# EAGLE design cd4017_ir_remote (EAGLE 8.3.2)
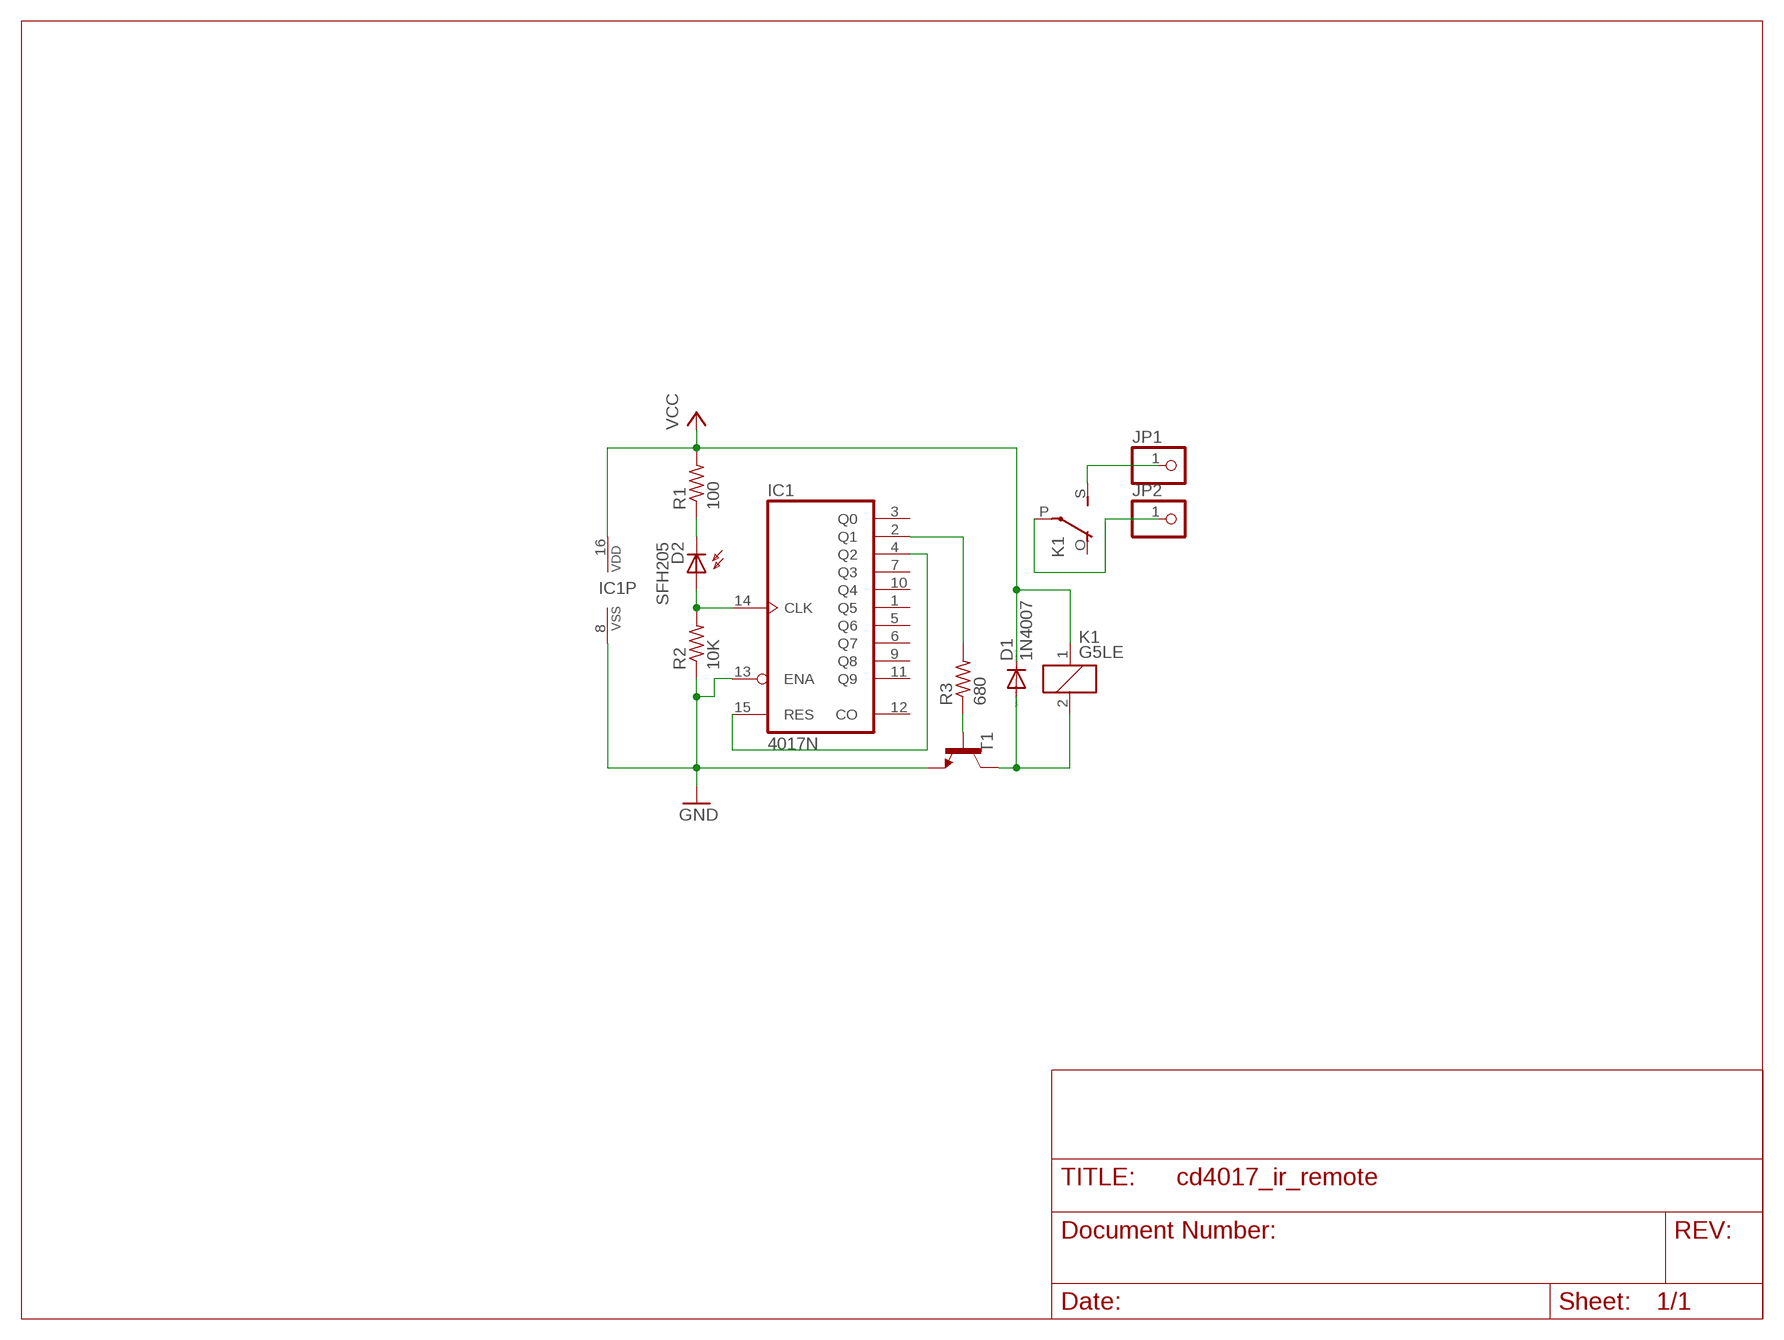
[diagram p0: schematic, sheet 1]

## Parts
D1  1N4007  1N4004  [DO41-10]
D2  SFH205  [SFH205]
IC1  4017N  [DIL16]
JP1  PINHD-1X1  [1X01]
JP2  PINHD-1X1  [1X01]
K1  G5LE  [G5LE]
R1  100  R-US_0204/7  [0204/7]
R2  10K  R-US_0204/7  [0204/7]
R3  680  R-US_0204/7  [0204/7]
T1  2N2222-NPN-TO92-EBC  [TO92-EBC]

## Nets
GND: IC1.8(VSS) IC1.13(ENA) R2.1 T1.E
N$1: IC1.4(Q2) IC1.15(RES)
N$2: R3.1 T1.B
N$3: D1.A K1.2 T1.C
N$4: IC1.2(Q1) R3.2
N$5: D2.A IC1.14(CLK) R2.2
N$6: D2.K(C) R1.1
N$7: JP2.1 K1.P(2:P)
N$8: JP1.1 K1.S(2:S)
VCC: D1.C IC1.16(VDD) K1.1 R1.2
Unconnected: IC1.1(Q5) IC1.3(Q0) IC1.5(Q6) IC1.6(Q7) IC1.7(Q3) IC1.9(Q8) IC1.10(Q4) IC1.11(Q9) IC1.12(CO) K1.O(2:O)

## Library data of the parts
D1 = diode:1N4004: DIODE general purpose rectifier, 1 A
D2 = opto-trans-siemens:SFH205: PHOTO DIODE; OC_FARNELL: unknown; OC_NEWARK: unknown
IC1 = 40xx:4017: COUNTER/DIVIDER
JP1 JP2 = pinhead:PINHD-1X1: PIN HEADER
K1 = relay:G5LE: RELAY 1 x switch, 10 A/120 V AC, 8 A/30 V DC, Omron; OC_FARNELL: unknown; OC_NEWARK: unknown
R1-R3 = resistor:R-US_: RESISTOR, American symbol
T1 = transistor-neu-to92:*-NPN-: NPN Transistror

## Board
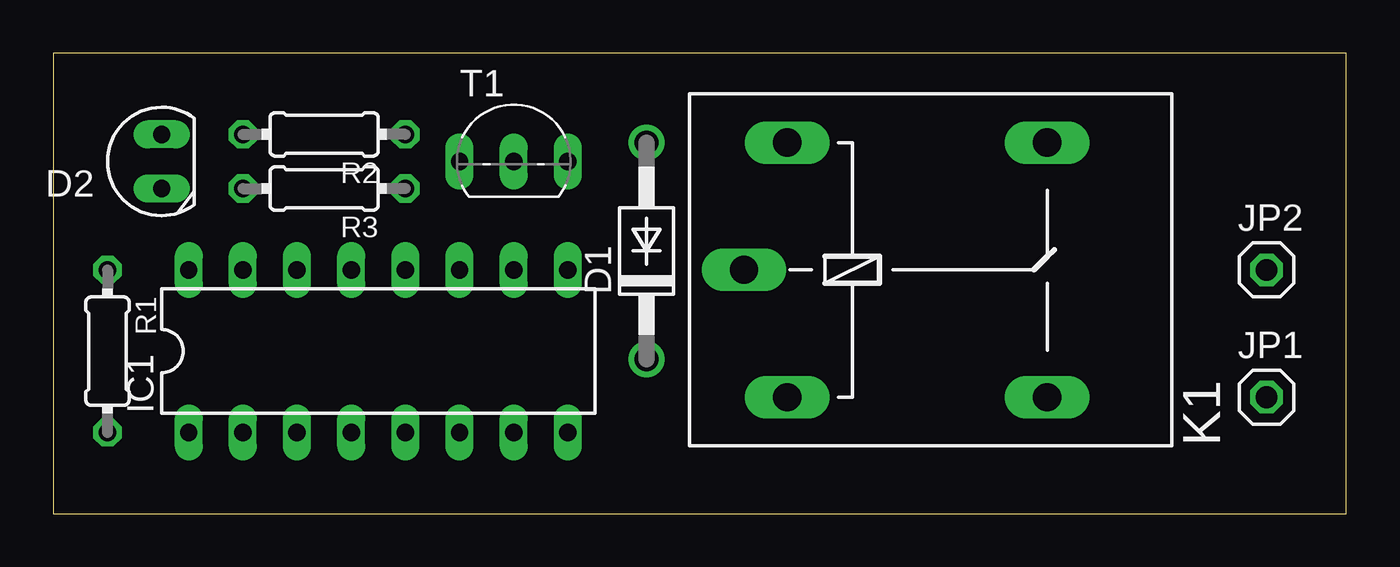
[diagram p1: board, top side]
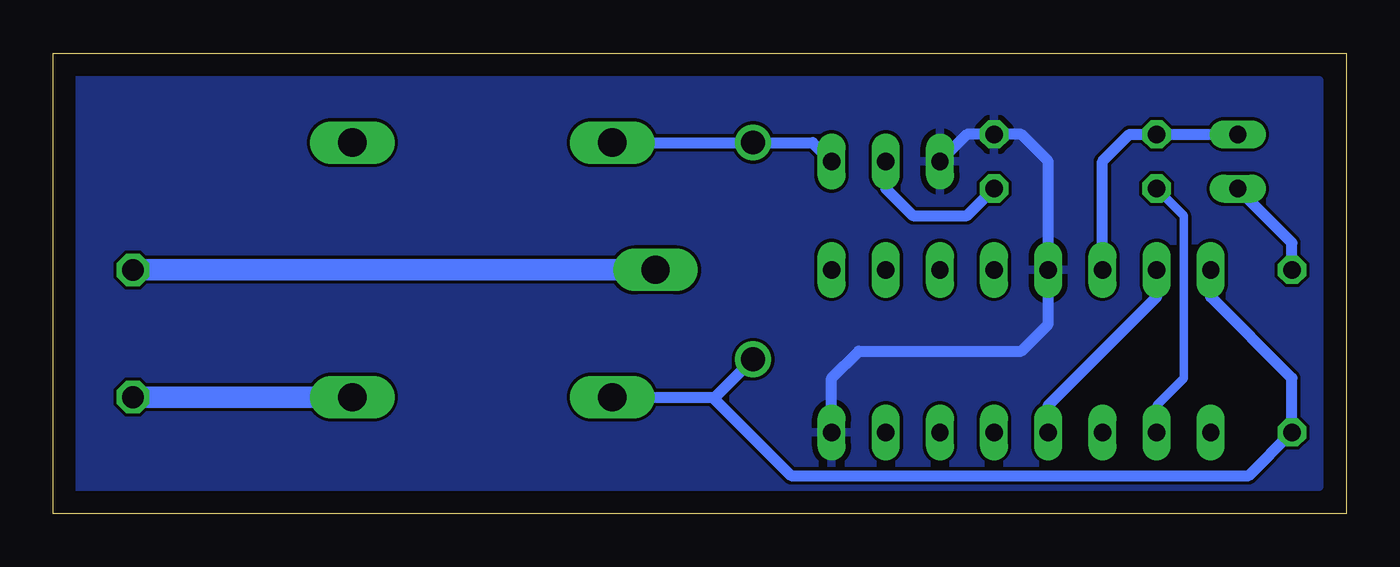
[diagram p2: board, bottom side, seen from below]

Size 60.63 x 21.58 mm. Coordinates in mm from the lower left corner, seen from the top.
Outline: 0,0 60.63,0 60.63,21.58 0,21.58 0,0
Copper layers (1*16): Top 0.035mm / dielectric 1.5mm / Bottom 0.035mm
Design rules "default": minimum track width 6mil, minimum drill 0.35mm, track to track 6mil, track to pad 6mil, pad to pad 6mil, via to via 6mil, smd to smd 6mil, copper to edge 40mil, drill to drill 6mil, minimum pad ring 10mil, minimum via ring 8mil, stop-mask expansion 4mil, vias tented up to drill 0mil, thermal gap 10mil

### Footprints (pad centres in the part's own frame; a part is rotated, then mirrored left to right if it is on the bottom)
DO41-10 = drill 1.118: A 5.08,0; C -5.08,0
SFH205 = drill 0.813 long: A 0,-1.27; K 0,1.27
DIL16 = drill 0.813 long: 1 -8.89,-3.81; 2 -6.35,-3.81; 3 -3.81,-3.81; 4 -1.27,-3.81; 5 1.27,-3.81; 6 3.81,-3.81; 7 6.35,-3.81; 8 8.89,-3.81; 9 8.89,3.81; 10 6.35,3.81; 11 3.81,3.81; 12 1.27,3.81; 13 -1.27,3.81; 14 -3.81,3.81; 15 -6.35,3.81; 16 -8.89,3.81
1X01 = drill 1.016 octagon: 1 0,0
G5LE = drill 1.321 long: 1 -7.493,-5.969; 2 -7.493,5.969; O 4.699,5.969; P -9.525,0; S 4.699,-5.969
0204/7 = drill 0.813 octagon: 1 -3.81,0; 2 3.81,0
TO92-EBC = drill 0.813 long: B 0,-1.27; C 2.54,-1.27; E -2.54,-1.27

### Placement (x,y rotation side)
D1  27.81,12.32 90 top
D2  5.08,16.51 180 top
IC1  15.24,7.62 0 top
JP1  56.9,5.46 0 top
JP2  56.9,11.43 0 top
K1  41.91,11.43 0 top
R1  2.54,7.62 270 top
R2  12.7,17.78 180 top
R3  12.7,15.24 180 top
T1  21.59,17.78 0 top

### Tracks (layer width: path | path; a pad name or v marks a point on that pad's centre or on a via)
GND
  Bottom 0.508: T1.E 17.78,17.78 R2.1 15.24,17.78 13.97,16.51 IC1.13 13.97,8.89 15.24,7.62 22.86,7.62 24.13,6.35 IC1.8
  pour Bottom: 59.69,1.27 1.27,1.27 1.27,20.32 59.69,20.32
N$1
  Bottom 0.508: IC1.15 8.89,10.16 13.97,5.08 IC1.4
N$2
  Bottom 0.508: T1.B 21.59,15.24 20.32,13.97 17.78,13.97 R3.1
N$3
  Bottom 0.508: K1.2 D1.A 25.02,17.4 T1.C
N$4
  Bottom 0.406: R3.2 7.62,13.97 7.62,6.35 8.89,5.08 IC1.2
N$5
  Bottom 0.508: D2.A R2.2 10.16,17.78 11.43,16.51 IC1.14
N$6
  Bottom 0.508: R1.1 2.54,12.7 D2.K
N$7
  Bottom 1.016: K1.P JP2.1
N$8
  Bottom 1.016: K1.S JP1.1
VCC
  Bottom 0.508: K1.1 29.59,5.46 | 29.59,5.46 D1.C | 29.59,5.46 29.59,5.33 26.04,1.78 4.57,1.78 R1.2 2.54,6.35 6.35,10.16 IC1.16